# Altium schematic sheet GyroAccelHeaders.SchDoc
size A
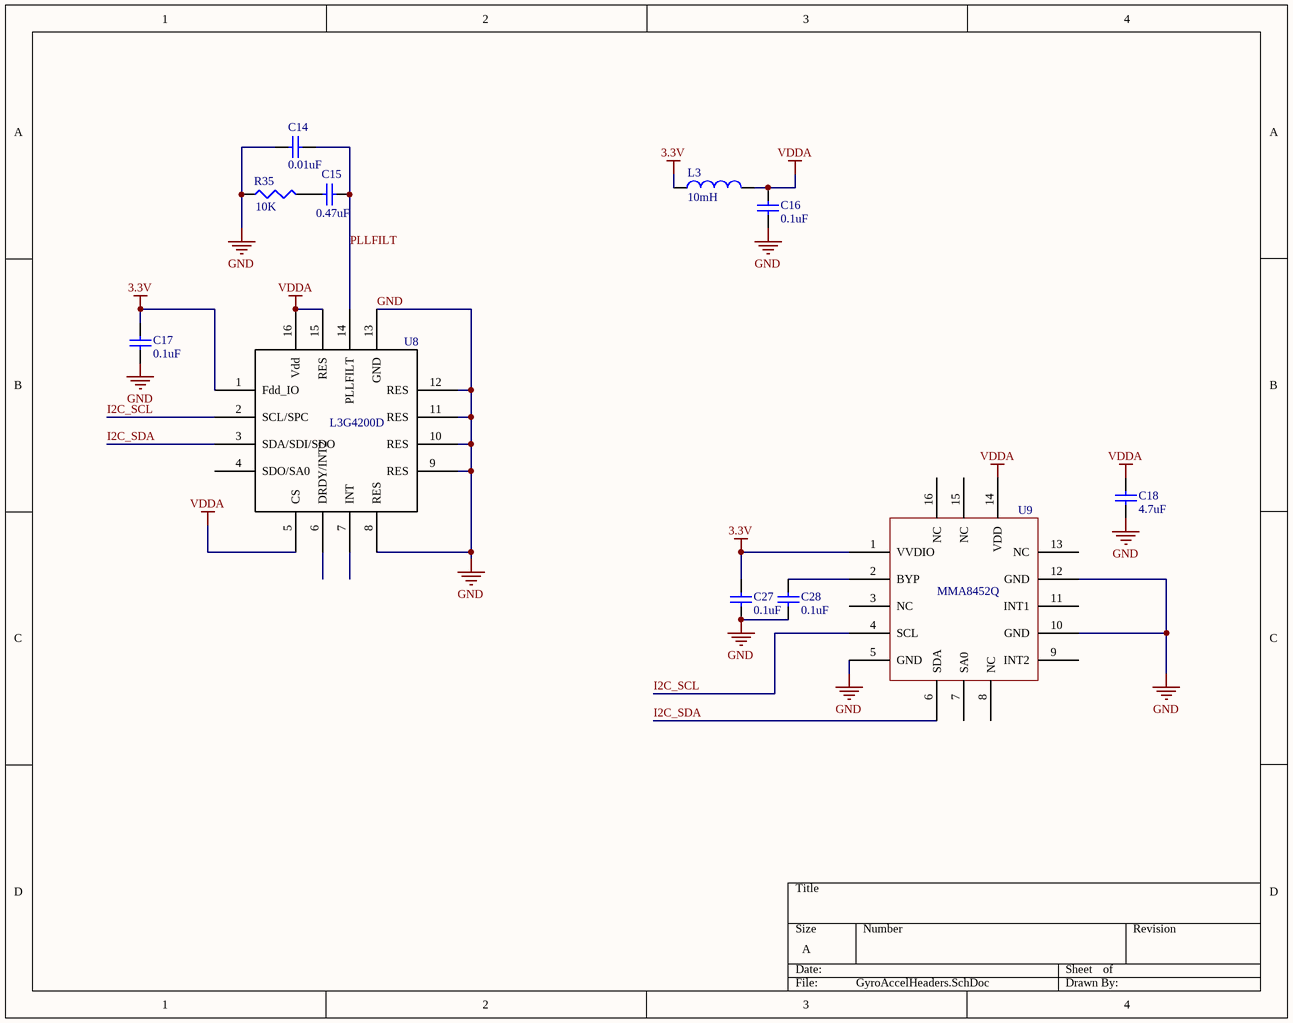
[diagram p0: GyroAccelHeaders.SchDoc]

## Parts
C14  value 0.01uF  [CAPC1005L]  (hidden comment: Cap Semi)
C15  value 0.47uF  [CAPC1005L]  (hidden comment: Cap Semi)
C16  value 0.1uF  [CAPC1005L]  (hidden comment: Cap Semi)
C17  value 0.1uF  [CAPC1005L]  (hidden comment: Cap Semi)
C18  value 4.7uF  [CAPC1005L]  (hidden comment: Cap Semi)
C27  value 0.1uF  [CAPC1005L]  (hidden comment: Cap Semi)
C28  value 0.1uF  [CAPC1005L]  (hidden comment: Cap Semi)
L3  value 10mH  [INDC2012L]  (hidden comment: Inductor)
R35  value 10K  [RESC1608L]  (hidden comment: Res3)
U8  L3G4200D  [L3G2004D]
U9  MMA8452Q  [MMA8452Q]

## Nets
3.3V: C17.2 C27.2 L3.2 U8.1(Fdd_IO) U9.1(VVDIO)
GND: C14.2 C16.1 C17.1 C18.1 C27.1 C28.1 R35.1 U8.8(RES) U8.9(RES) U8.10(RES) U8.11(RES) U8.12(RES) U8.13(GND) U9.5(GND) U9.10(GND) U9.12(GND)
VDDA: C16.2 C18.2 L3.1 U8.5(CS) U8.15(RES) U8.16(Vdd) U9.14(VDD)
I2C_SCL: U8.2(SCL/SPC) U9.4(SCL)
I2C_SDA: U8.3(SDA/SDI/SDO) U9.6(SDA)
PLLFILT: C14.1 C15.1 U8.14(PLLFILT)
NetC15_2: C15.2 R35.2
NetC28_2: C28.2 U9.2(BYP)

Not connected (* = marked no-connect by the designer): U8 4(SDO/SA0) 6(DRDY/INT2) 7(INT); U9 3(NC) 7(SA0) 8(NC) 9(INT2) 11(INT1) 13(NC) 15(NC) 16(NC)

## Library data of the parts
C14-C18 C27 C28 = Cap Semi: Capacitor (Semiconductor SIM Model); Published: 8-Jun-2000; LatestRevisionDate: 29-May-2009; LatestRevisionNote: IPC-7351 Footprint Added.; PackageReference: C1206; Publisher: Altium Limited; PackageDescription: Chip Capacitor
L3 = Inductor: Code_IEC: 1005; Published: 8-Jun-2000; LatestRevisionDate: 29-May-2009; LatestRevisionNote: IPC-7351 Footprint Added.; PackageReference: 0402-A; Publisher: Altium Limited; PackageDescription: Chip Inductor; Code_JEITA: 0402
R35 = Res3: Resistor; Published: 8-Jun-2000; LatestRevisionDate: 29-May-2009; LatestRevisionNote: IPC-7351 Footprint Added.; PackageReference: J1-0603; Publisher: Altium Limited; PackageDescription: Chip Resistor
U8 = L3G4200D: 3axis gyroscope, SPI